# EasyEDA Pro project 电子琴键盘板.eprj

# Schematic Schematic1
Board Name: Board1; Create Date: 2026-02-20; Page Name: P1; Project Name: 电子琴键盘板; Schematic Name: Schematic1; Update Date: 2026-02-20; BladeWidth: 10; Company: 嘉立创EDA; Page Size: A4; RegionStart: 1; ShowBorder: 1; TitleBlock: 1; TitleBlockPosition: 3; Version: V1.0; XRegionCount: 6; YRegionCount: 4
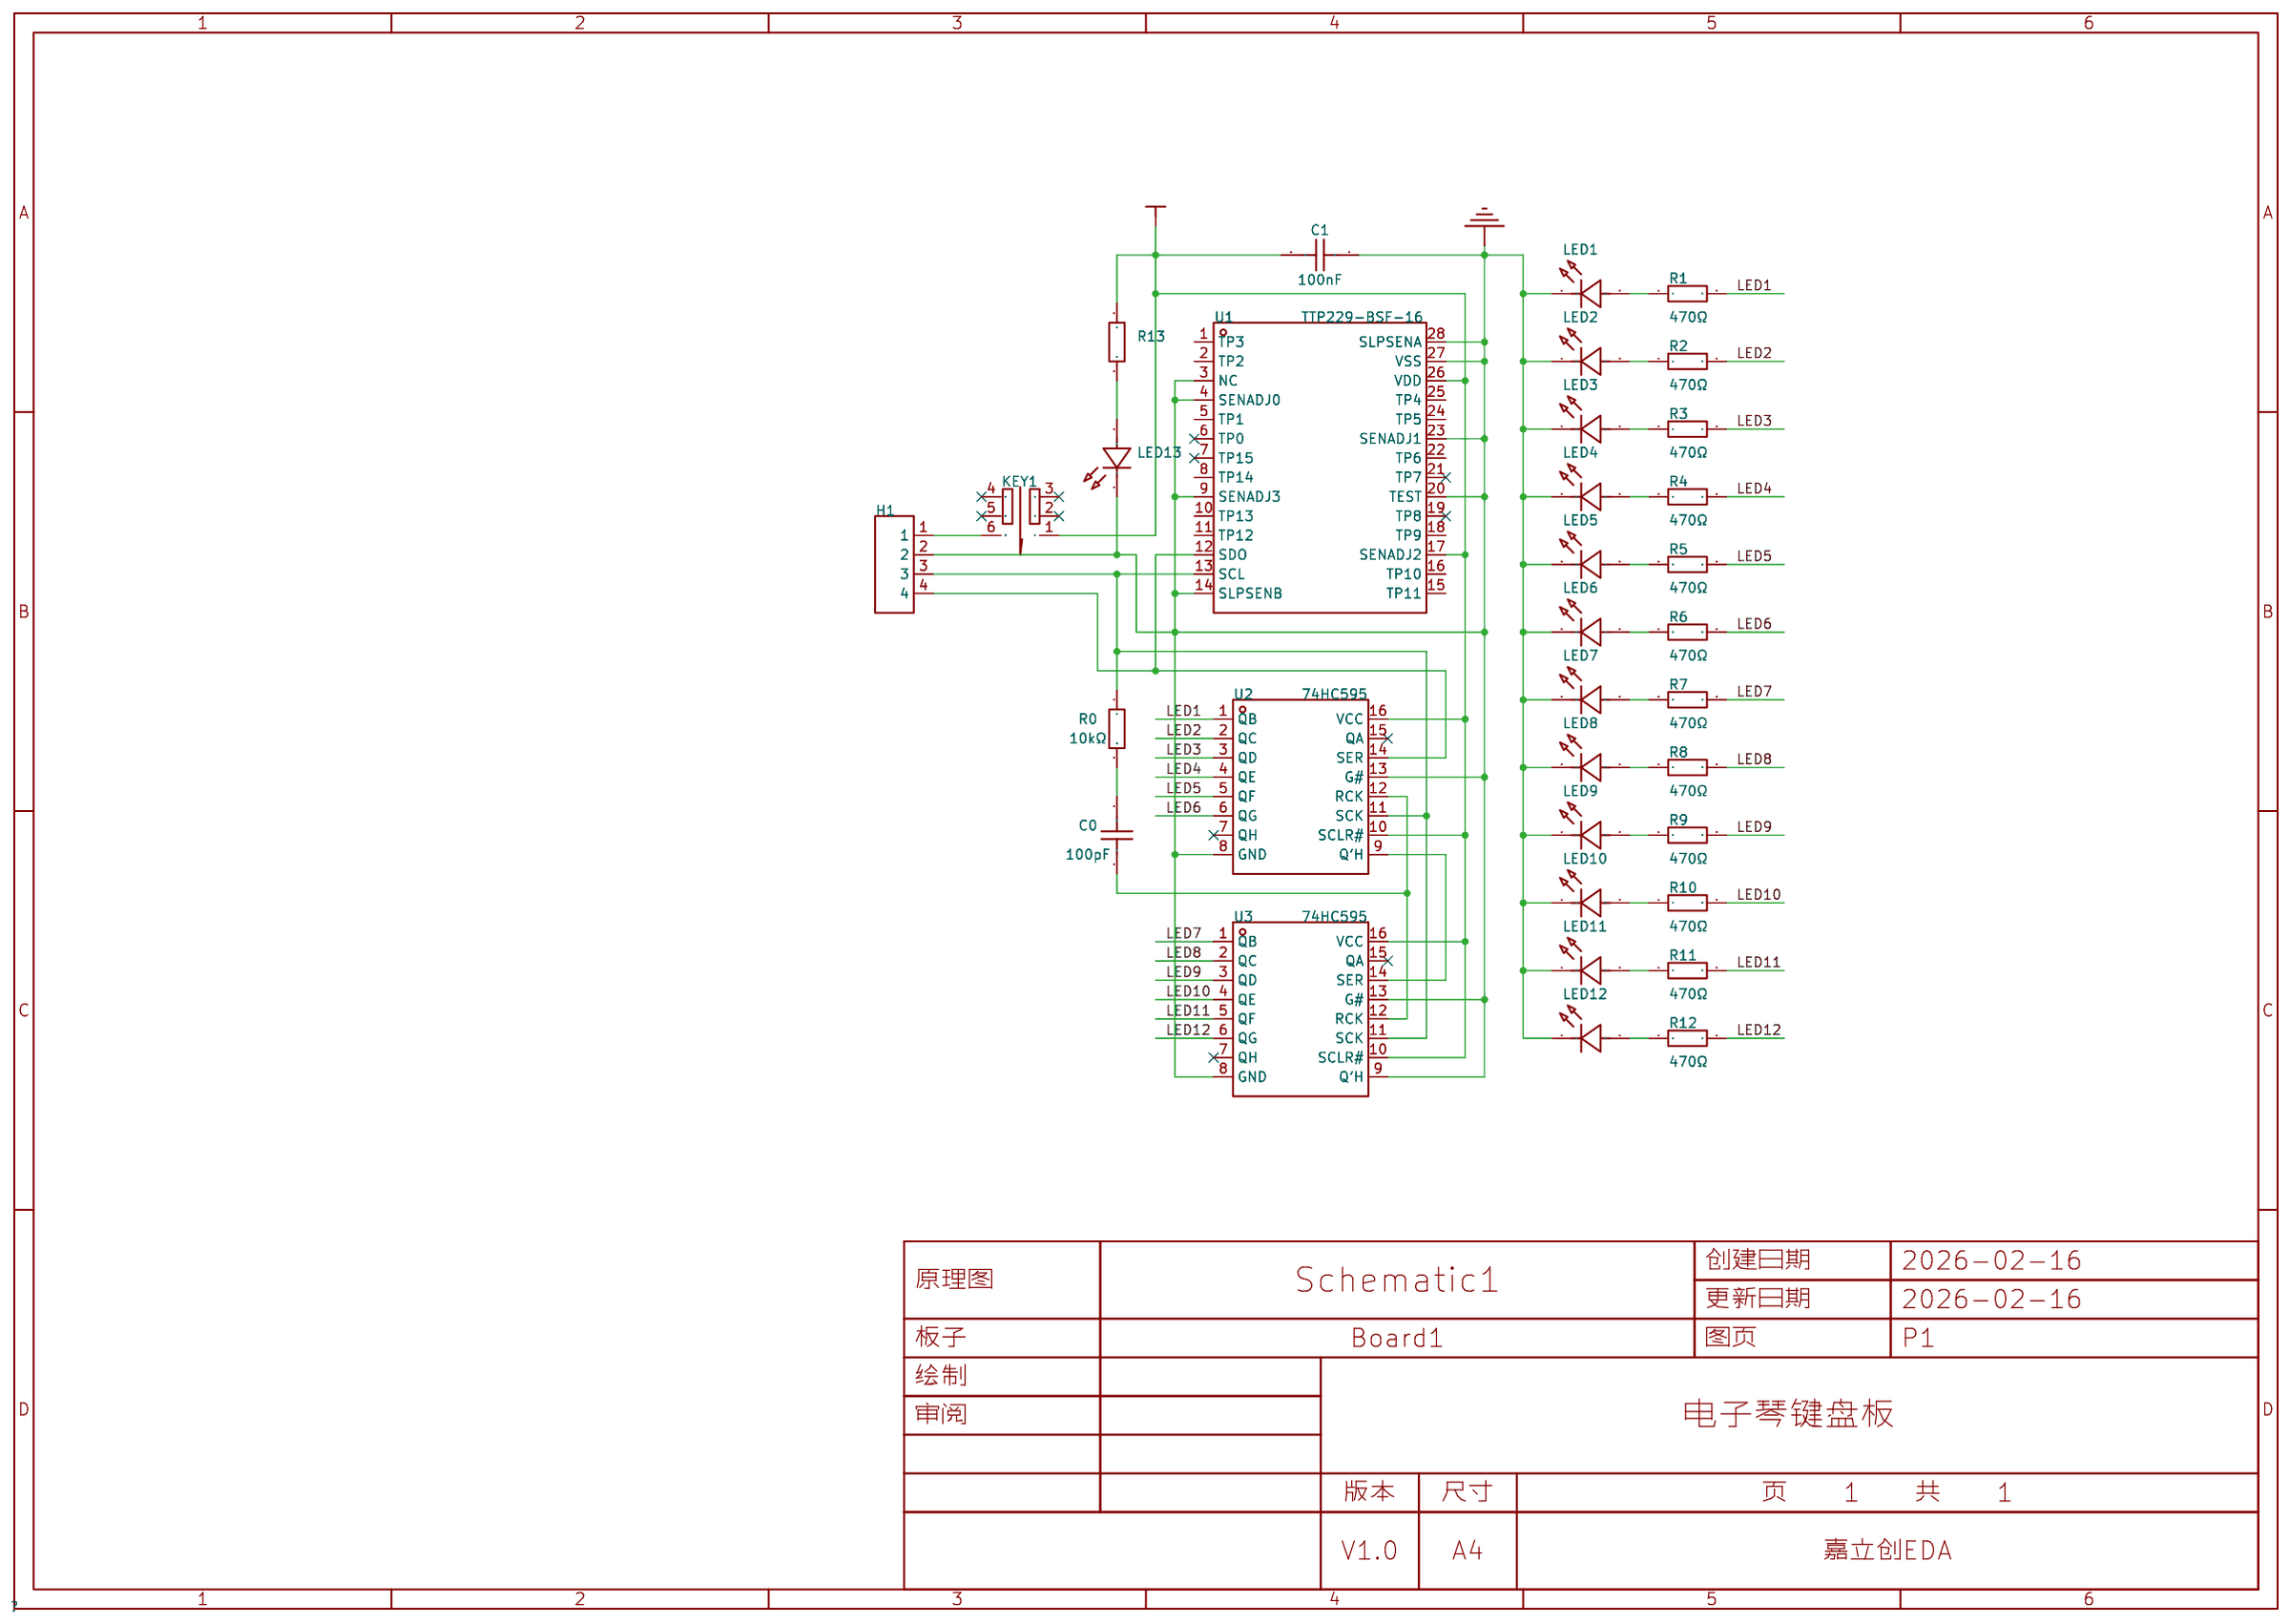
[diagram p0: schematic sheet]

## Parts
C0  100pF  [C0603]
C1  100nF  [C0603]
H1  2.54-1*4  [HDR-TH_4P-P2.54-V-M-1]
KEY1  自锁开关 5.8Z白灰白260G  [SW-TH_6P-L5.8-W5.8-P2.00-LS4.5-TR]
LED1  GL0603UB01  [LED0603-RD_BLUE]
LED2  GL0603UB01  [LED0603-RD_BLUE]
LED3  GL0603UB01  [LED0603-RD_BLUE]
LED4  GL0603UB01  [LED0603-RD_BLUE]
LED5  GL0603UB01  [LED0603-RD_BLUE]
LED6  GL0603UB01  [LED0603-RD_BLUE]
LED7  GL0603UB01  [LED0603-RD_BLUE]
LED8  GL0603UB01  [LED0603-RD_BLUE]
LED9  GL0603UB01  [LED0603-RD_BLUE]
LED10  GL0603UB01  [LED0603-RD_BLUE]
LED11  GL0603UB01  [LED0603-RD_BLUE]
LED12  GL0603UB01  [LED0603-RD_BLUE]
LED13  GL0603UB01  [LED0603-RD_BLUE]
R0  10kΩ  [R0603]
R1  470Ω  [R0603]
R2  470Ω  [R0603]
R3  470Ω  [R0603]
R4  470Ω  [R0603]
R5  470Ω  [R0603]
R6  470Ω  [R0603]
R7  470Ω  [R0603]
R8  470Ω  [R0603]
R9  470Ω  [R0603]
R10  470Ω  [R0603]
R11  470Ω  [R0603]
R12  470Ω  [R0603]
R13  1kΩ  [R0603]
U1  TTP229-BSF-16  [SSOP-28_L9.9-W3.9-P0.64-LS6.0-BL]
U2  74HC595  [SOP-16_L9.9-W3.9-P1.27-LS6.0-BL]
U3  74HC595  [SOP-16_L9.9-W3.9-P1.27-LS6.0-BL]

## Library data of the parts
C0 = CC0603JRNPO9BN101: 容值:100pF;精度:±5%;额定电压:50V;温度系数:NP0;; LCSC Part Name: 100pF ±5% 50V; Supplier Part: C14665; Manufacturer: YAGEO(国巨); Supplier Footprint: 0603; JLCPCB Part Class: 扩展库; Datasheet: https://item.szlcsc.com/datasheet/CC0603JRNPO9BN101/15333.html; Supplier: LCSC; Tolerance: ±5%; Voltage Rating: 50V; Temperature Coefficient: NP0
C1 = CGA0603X7R104K500JT: 容值:100nF;精度:±10%;额定电压:50V;温度系数:X7R;; LCSC Part Name: 100nF ±10% 50V; Supplier Part: C6119867; Manufacturer: HRE(芯声); Supplier Footprint: 0603; JLCPCB Part Class: 扩展库; Datasheet: https://item.szlcsc.com/datasheet/CGA0603X7R104K500JT/7062573.html; Supplier: LCSC; Tolerance: ±10%; Voltage Rating: 50V; Temperature Coefficient: X7R
H1 = 2.54-1*4: 插针结构:1x4P;间距:2.54mm;圆针/方针:方针;安装方式:直插;排数:单排;总PIN位数:4P;额定电流:2.5A;配合针长度:6mm;塑高:2.54mm;端接针长度:3mm;触头材质:黄铜;触头镀层:金;工作温度:-40℃~+105℃;; LCSC Part Name: 1x4P 间距:2.54mm 方针 直插; Supplier Part: C5116483; Manufacturer: ZHOURI(洲日); Supplier Footprint: 插件,P=2.54mm; JLCPCB Part Class: Extended Part; Datasheet: https://item.szlcsc.com/datasheet/2.54-1*4/5692726.html; Supplier: LCSC; Pin Structure: 1x4P; Pitch: 2.54mm; Circluar Pins/Square Pins: 方针; Mounting Type: 直插; Number of Rows: 单排; Number of Pins: 4P; Current Rating: 2.5A; Length of Mating Pin: 6mm; Insulation Height: 2.54mm; Length of End Connection Pin: 3mm; Contact Material: 黄铜; Contact Plating: 金; Operating Temperature: -40℃~+105℃
KEY1 = 自锁开关 5.8Z白灰白260G: 耐温260度; LCSC Part Name: 自锁开关 5.8Z白灰白 260G  5.8*5.8mm; Supplier Part: C56857; Supplier Footprint: 插件; JLCPCB Part Class: Extended Part; Supplier: LCSC
LED1-LED13 = GL0603UB01: 发光颜色:蓝色;正向压降(Vf):2.9V;正向电流:20mA;波长:460nm~469nm;二极管配置:独立二极管;透镜颜色:无色透明透镜;发光强度:72mcd;发光角度:120°;载带方式:正贴;工作温度:-40℃~+85℃;; LCSC Part Name: 0603 蓝灯 高亮; Supplier Part: C51933294; Manufacturer: Guiguang light(桂光光电); Supplier Footprint: 0603; JLCPCB Part Class: Extended Part; Datasheet: https://item.szlcsc.com/datasheet/GL0603UB01/54645990.html; Supplier: LCSC; Illumination Color: 蓝色; Voltage - Forward(Vf): 2.9V; Forward Current: 20mA; Wavelength - Dominant: 460nm~469nm; Diode Configuration: 独立二极管; Lens Color: 无色透明透镜; Luminous Intensity: 72mcd; Viewing Angle: 120°; Mounting Style: 正贴; Operating Temperature: -40℃~+85℃
R0 = 0603WAF1002T5E: 电阻类型:厚膜电阻;阻值:10kΩ;精度:±1%;功率:100mW;工作电压:75V;温度系数:±100ppm/℃;; LCSC Part Name: 厚膜电阻 10kΩ ±1% 100mW; Supplier Part: C25804; Manufacturer: UNI-ROYAL(厚声); Supplier Footprint: 0603; JLCPCB Part Class: Basic Part; Datasheet: https://item.szlcsc.com/datasheet/0603WAF1002T5E/26547.html; Supplier: LCSC; Type: 厚膜电阻; Tolerance: ±1%; Power(Watts): 100mW; Voltage-Supply(Max): 75V; Temperature Coefficient: ±100ppm/℃; Operating Temperature: -55℃~+155℃
R1-R12 = 0603WAF2000T5E: 电阻类型:厚膜电阻;阻值:200Ω;精度:±1%;功率:100mW;工作电压:75V;温度系数:±100ppm/℃;; LCSC Part Name: 200Ω ±1% 100mW 厚膜电阻; Supplier Part: C8218; Manufacturer: UNI-ROYAL(厚声); Supplier Footprint: 0603; JLCPCB Part Class: Basic Part; Datasheet: https://item.szlcsc.com/datasheet/0603WAF2000T5E/8708.html; Supplier: LCSC; Type: 厚膜电阻; Tolerance: ±1%; Power(Watts): 100mW; Voltage-Supply(Max): 75V; Temperature Coefficient: ±100ppm/℃; Operating Temperature: -55℃~+155℃
R13 = RC0603FR-071KL: 电阻类型:厚膜电阻;阻值:1kΩ;精度:±1%;功率:100mW;工作电压:75V;温度系数:±100ppm/℃;; LCSC Part Name: 厚膜电阻 1kΩ ±1% 100mW; Supplier Part: C22548; Manufacturer: YAGEO(国巨); Supplier Footprint: 0603; JLCPCB Part Class: Extended Part; Datasheet: https://item.szlcsc.com/datasheet/RC0603FR-071KL/23274.html; Supplier: LCSC; Type: 厚膜电阻; Tolerance: ±1%; Power(Watts): 100mW; Voltage-Supply(Max): 75V; Temperature Coefficient: ±100ppm/℃; Operating Temperature: -55℃~+155℃
U1 = TTP229-BSF-16: 芯片功能:电容式触摸;; LCSC Part Name: 停产 16键或8键触摸板检测IC; Supplier Part: C82529; Manufacturer: TONTEK(通泰); Supplier Footprint: SSOP-28-150mil; JLCPCB Part Class: 扩展库; Datasheet: https://item.szlcsc.com/datasheet/TTP229-BSF-16/83686.html; Supplier: LCSC; Chip Function: 电容式触摸; Voltage - Supply: 2.4V~5.5V; Current - Supply: 20uA; Operating Temperature: -40℃~+85℃; Standby Current: 2.5uA; ESD Protection Voltage: 6kV; Response Time (tr): 16ms
U2 U3 = 74HC595: 功能:串行至串行或并行;工作电压:2V~6V;时钟频率(fc):10MHz;元件数:1;每个元件位数:8;; LCSC Part Name: 8位CMOS移位寄存器; Supplier Part: C18164493; Manufacturer: GR(国睿); Supplier Footprint: SOP-16; JLCPCB Part Class: 扩展库; Datasheet: https://item.szlcsc.com/datasheet/74HC595/19305556.html; Supplier: LCSC; Function: 串行至串行或并行; Voltage - Supply: 2V~6V; Clock Frequency: 10MHz; Number of Elements: 1; Number of Bits per Element: 8; Output Type: 三态; Series: 74HC; Operating Temperature: -40℃~+85℃; Propagation Delay: 100ns@5V,50pF

## Nets
GND: C1.1 H1.2 LED1.1(K) LED2.1(K) LED3.1(K) LED4.1(K) LED5.1(K) LED6.1(K) LED7.1(K) LED8.1(K) LED9.1(K) LED10.1(K) LED11.1(K) LED12.1(K) LED13.1(K) U1.3(NC) U1.4(SENADJ0) U1.9(SENADJ3) U1.14(SLPSENB) U1.20(TEST) U1.23(SENADJ1) U1.27(VSS) U1.28(SLPSENA) U2.8(GND) U2.13(G#) U3.8(GND) U3.9(Q′H) U3.13(G#)
VCC: C1.2 KEY1.1 R13.1 U1.17(SENADJ2) U1.26(VDD) U2.10(SCLR#) U2.16(VCC) U3.10(SCLR#) U3.16(VCC)
LED1: R1.2 U2.1(QB)
LED2: R2.2 U2.2(QC)
LED3: R3.2 U2.3(QD)
LED4: R4.2 U2.4(QE)
LED5: R5.2 U2.5(QF)
LED6: R6.2 U2.6(QG)
LED7: R7.2 U3.1(QB)
LED8: R8.2 U3.2(QC)
LED9: R9.2 U3.3(QD)
LED10: R10.2 U3.4(QE)
LED11: R11.2 U3.5(QF)
LED12: R12.2 U3.6(QG)
$1N2325: U2.9(Q′H) U3.14(SER)
$1N2334: H1.4 U1.12(SDO) U2.14(SER)
$1N3234: C0.2 U2.12(RCK) U3.12(RCK)
$1N3332: H1.3 R0.1 U1.13(SCL) U2.11(SCK) U3.11(SCK)
$1N3349: C0.1 R0.2
$1N5846: H1.1 KEY1.6
Net-(LED1-2): LED1.2(A) R1.1
Net-(LED2-2): LED2.2(A) R2.1
Net-(LED3-2): LED3.2(A) R3.1
Net-(LED4-2): LED4.2(A) R4.1
Net-(LED5-2): LED5.2(A) R5.1
Net-(LED6-2): LED6.2(A) R6.1
Net-(LED7-2): LED7.2(A) R7.1
Net-(LED8-2): LED8.2(A) R8.1
Net-(LED9-2): LED9.2(A) R9.1
Net-(LED10-2): LED10.2(A) R10.1
Net-(LED11-2): LED11.2(A) R11.1
Net-(LED12-2): LED12.2(A) R12.1
Net-(LED13-2): LED13.2(A) R13.2

Not connected (* = marked no-connect by the designer): KEY1 2* 3* 4* 5*; U1 1(TP3) 2(TP2) 5(TP1) 6(TP0)* 7(TP15)* 8(TP14) 10(TP13) 11(TP12) 15(TP11) 16(TP10) 18(TP9) 19(TP8)* 21(TP7)* 22(TP6) 24(TP5) 25(TP4); U2 7(QH)* 15(QA)*; U3 7(QH)* 15(QA)*

# Board PCB2
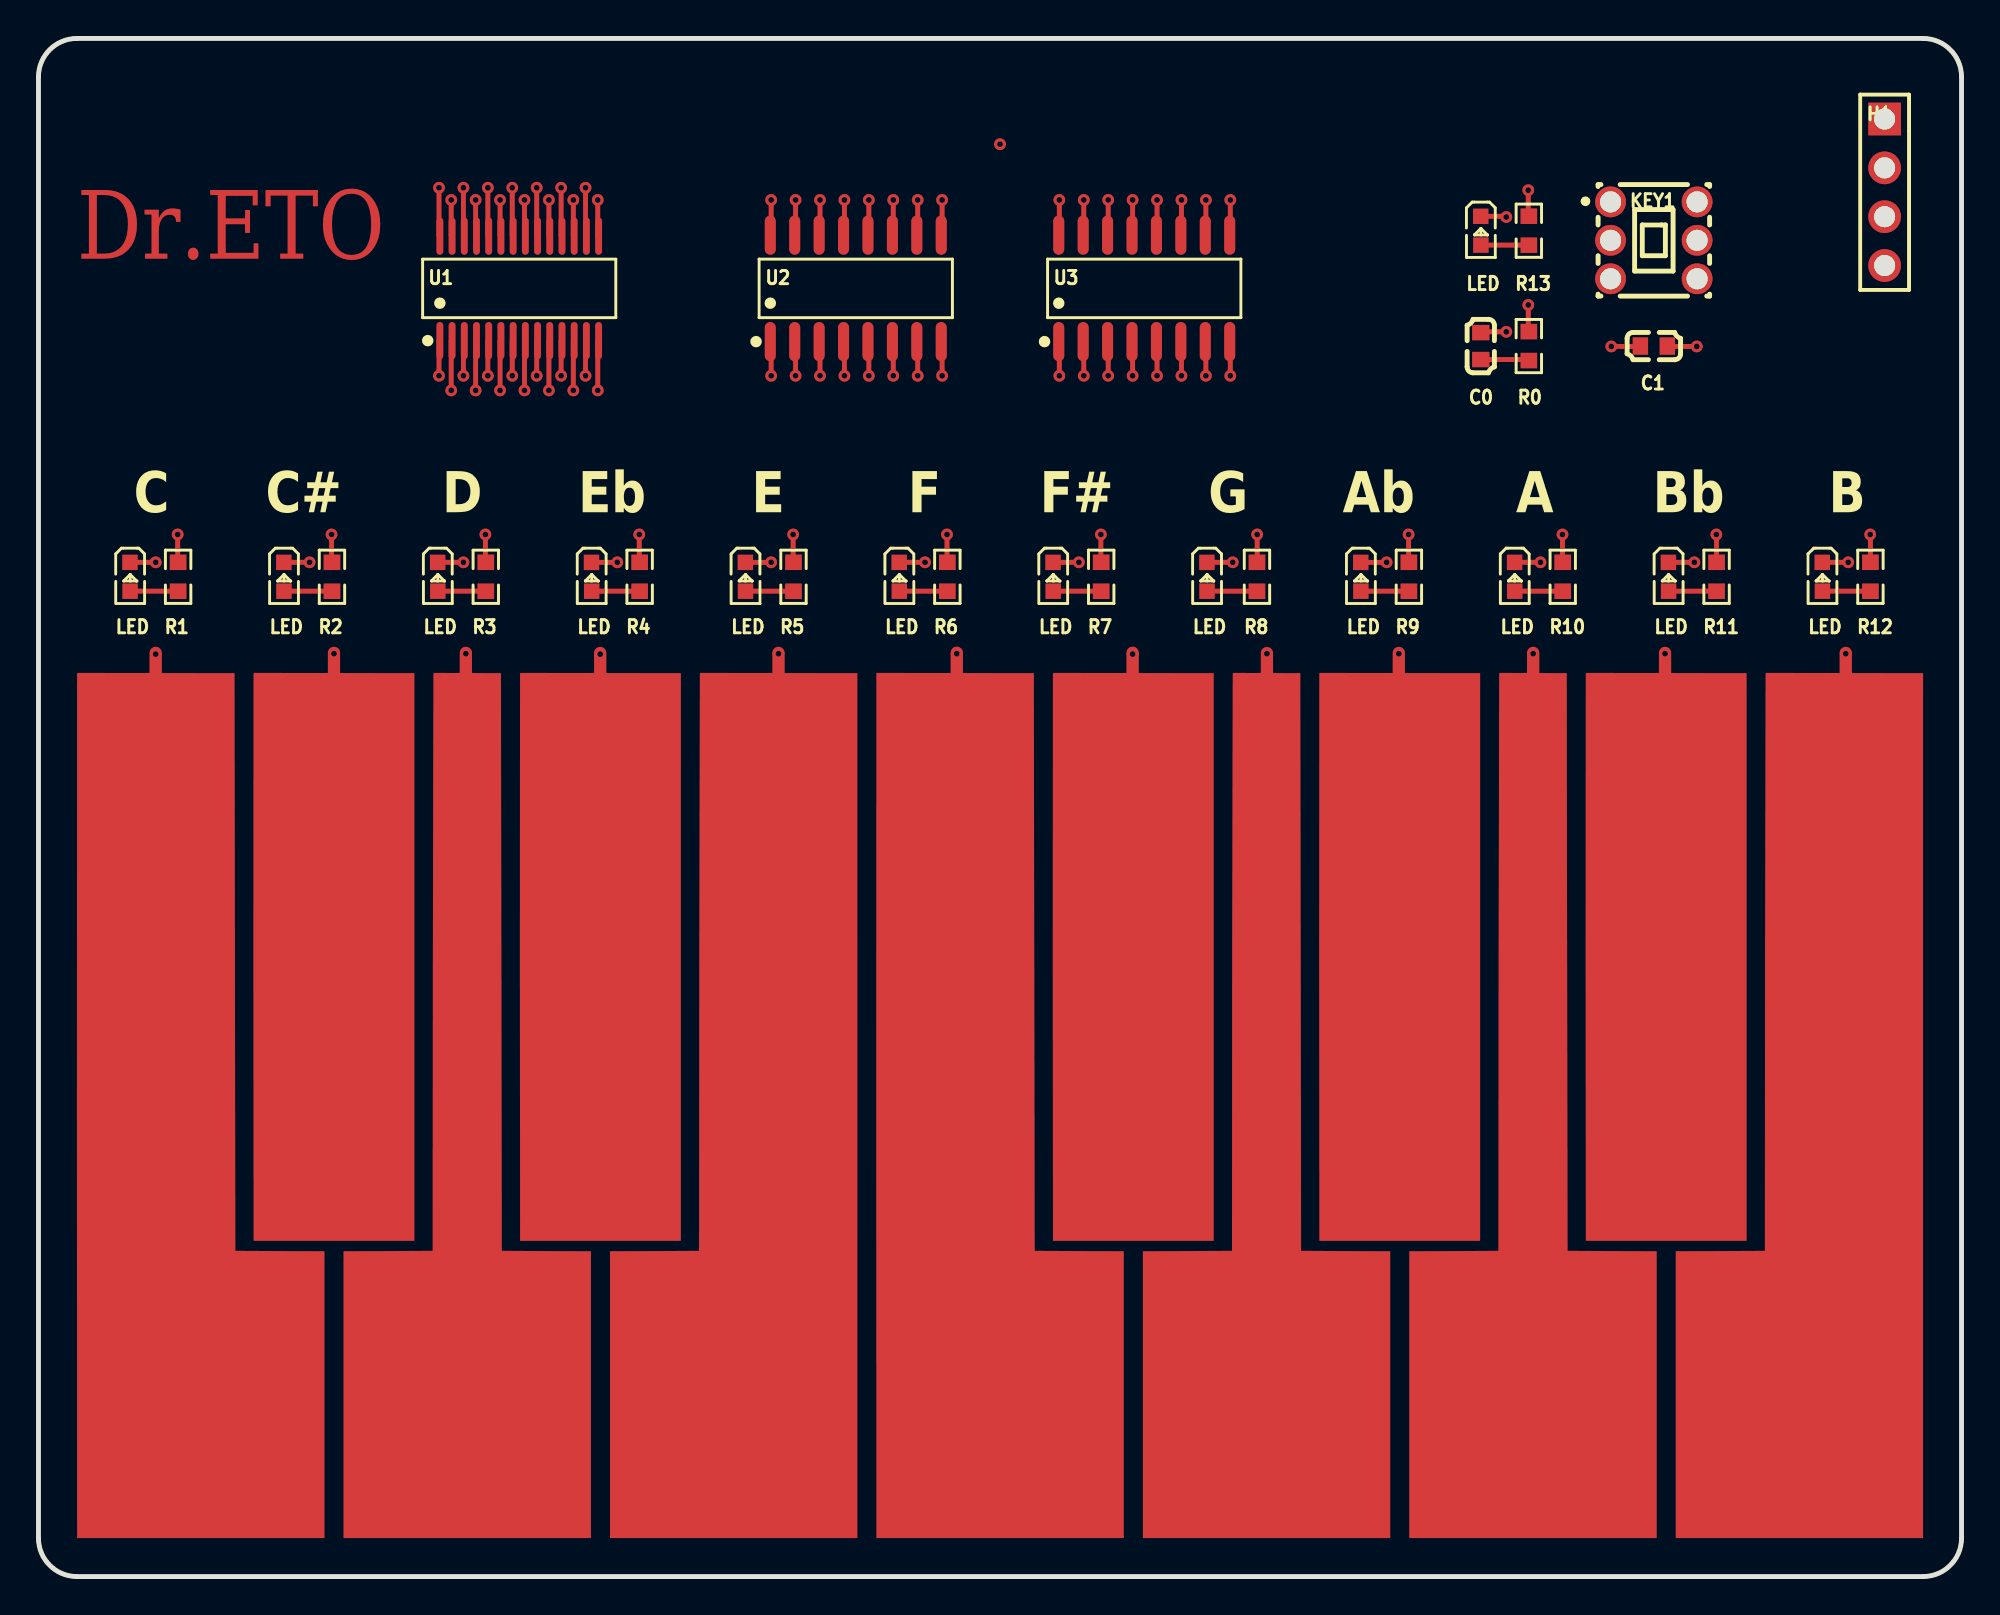
[diagram p1: board, top side]
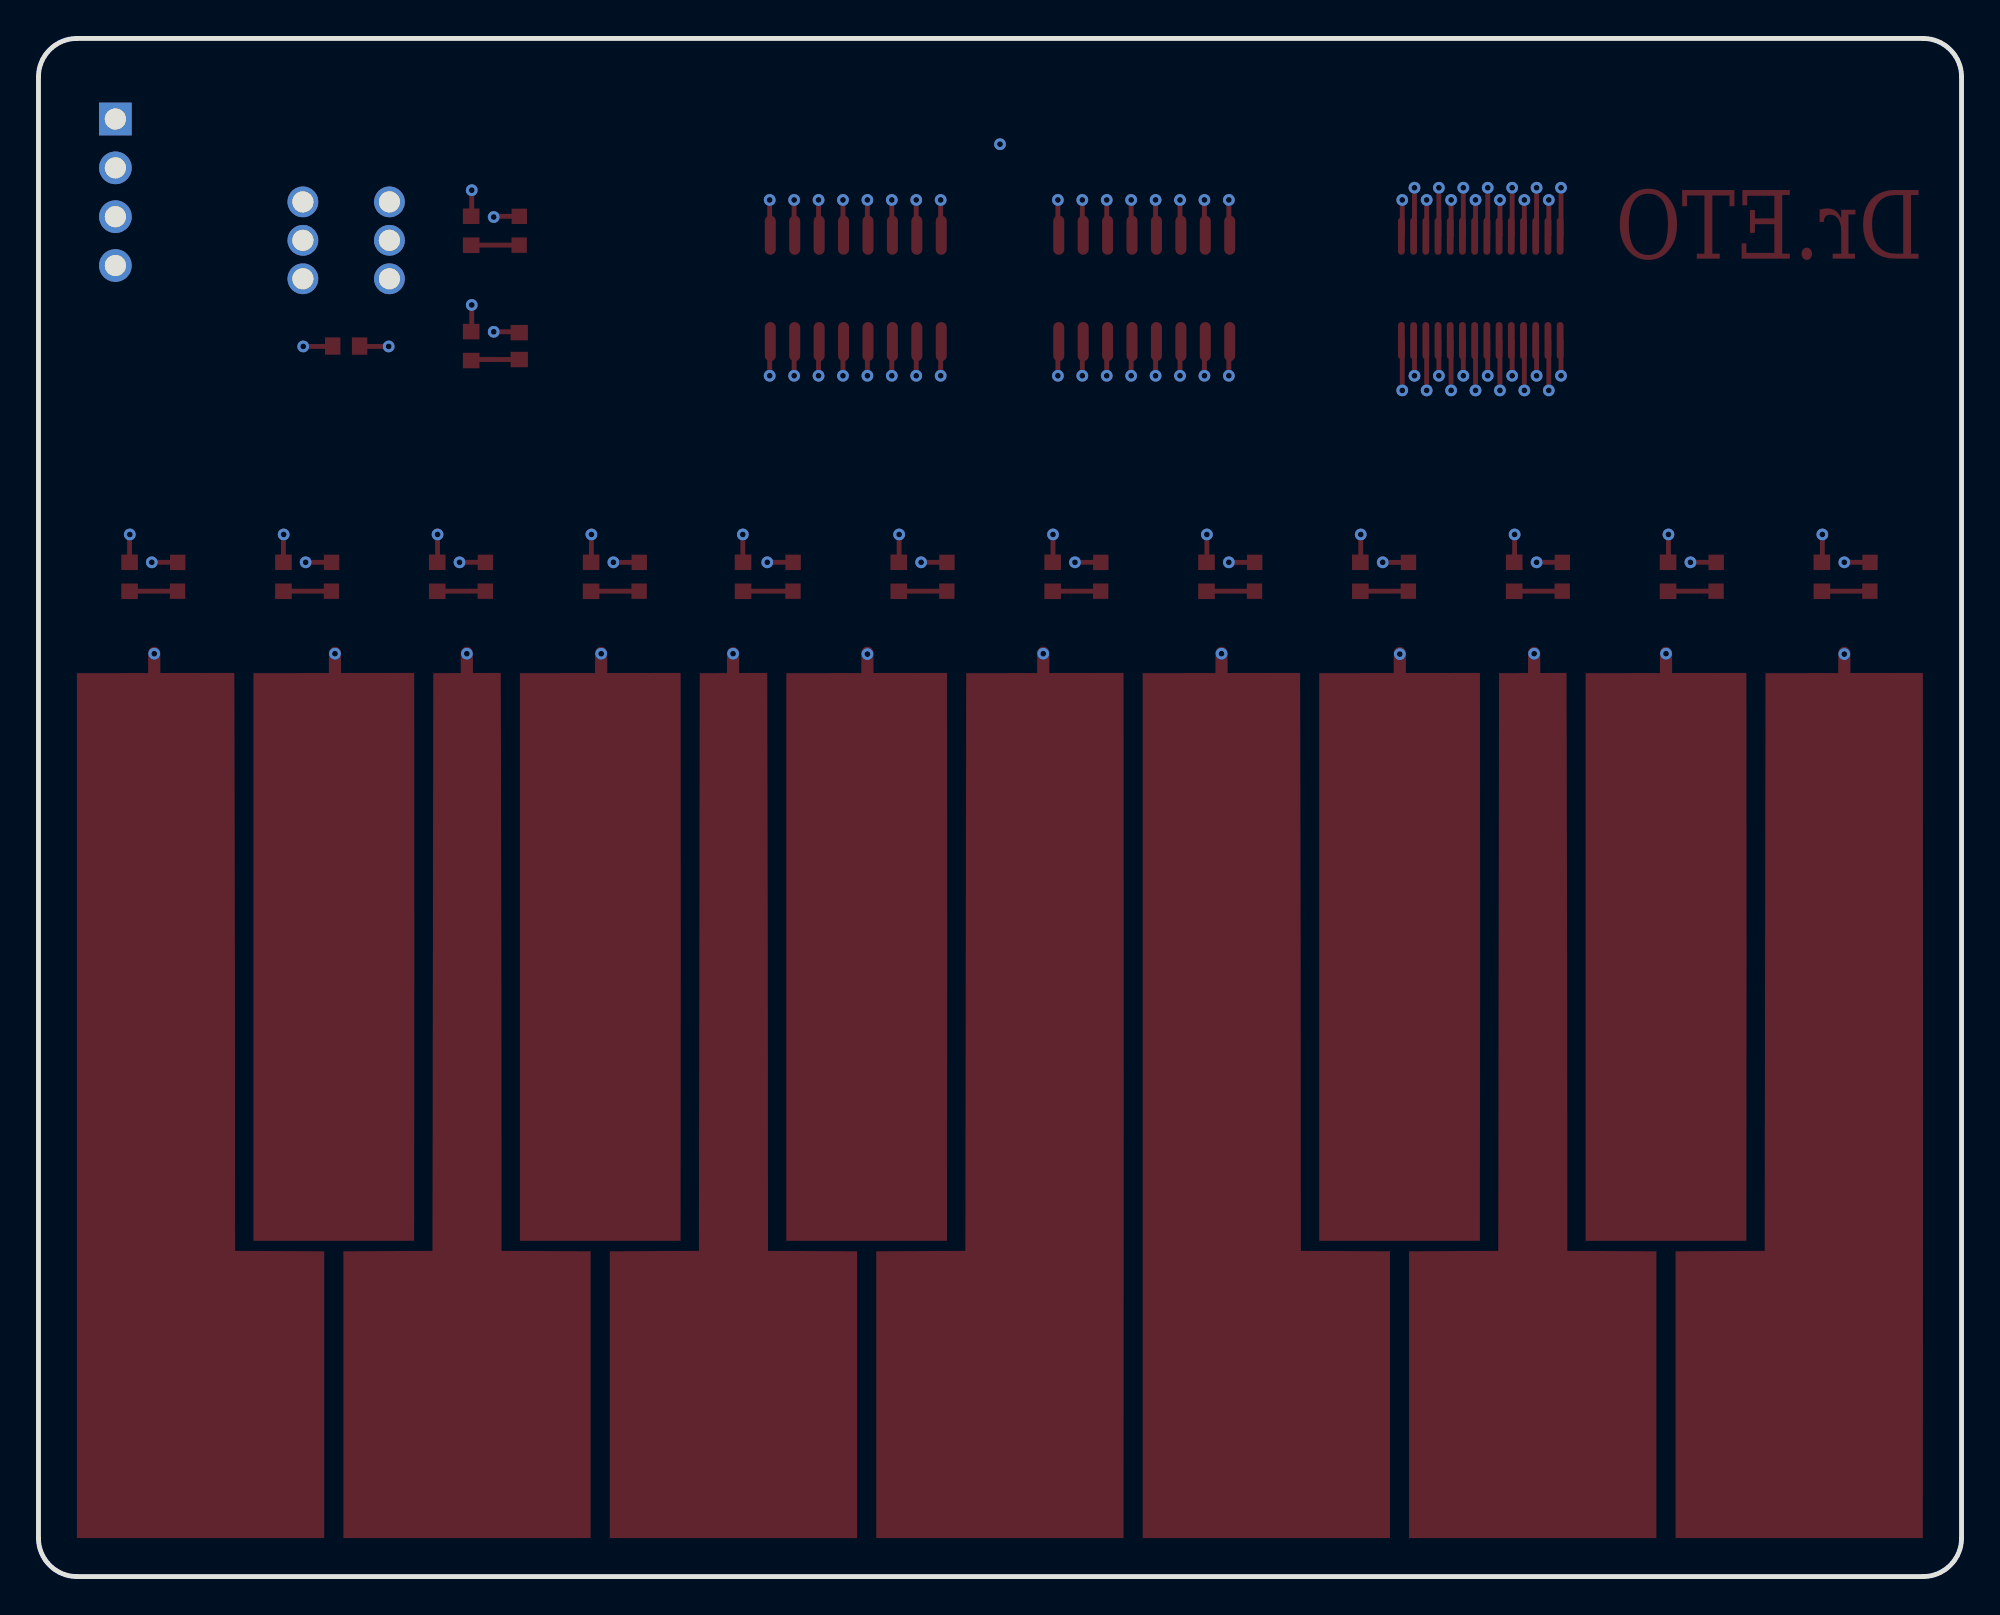
[diagram p2: board, bottom side, seen from below]

Outline 100 x 80 mm; copper layers: Top Layer, Inner1, Inner2, Bottom Layer. Coordinates in mm from the lower left corner of the outline.
Outline path: 0,78 0,2 arc(0.59,0.59) 2,0 98,0 arc(99.41,0.59) 100,2 100,78 arc(99.41,79.41) 98,80 2,80 arc(0.59,79.41) 0,78
Stack: Top Layer 0.035mm Outer layer thickness 1oz / Dielectric1 0.2104mm 7628 RC49% 8.6mil / Inner1 0.0152mm Inner layer thickness / Dielectric2 1.065mm 1.1mm H/HOZ Copper / Inner2 0.0152mm Inner layer thickness / Dielectric3 0.2104mm 7628 RC49% 8.6mil / Bottom Layer 0.035mm Outer layer thickness 1oz

## Design rules (mm)
spacing copperThickness1oz (default): track to track 0.102, other pairs 0.152 to 0.3
spacing copperThickness2oz: track to track 0.203, other pairs 0.152 to 0.3
spacing Plane_innerPlane: track to track 0.102, other pairs 0.152 to 0.3
spacing Copper_copperRegion: track to track 0.102, other pairs 0.152 to 0.3
track width copperThickness1oz (default): min 0.127, default 0.254, max 2.54
track width copperThickness2oz: min 0.203, default 0.254, max 2.54
differential pair differentialPair (default): width min 0.127, default 0.254, max 2.54; gap min 0.152, default 0.152

## Placement (name value [footprint] x y rotation side)
C0  100pF  [C0603]  75 64 90 top
C1  100nF  [C0603]  84 64 180 top
H1  2.54-1*4  [HDR-TH_4P-P2.54-V-M-1]  96 72 270 top
KEY1  自锁开关 5.8Z白灰白260G  [SW-TH_6P-L5.8-W5.8-P2.00-LS4.5-TR]  84 69.5 90 top
LED  -  [LED0603-RD_BLUE]  92.76 52 270 top
LED#2  -  [LED0603-RD_BLUE]  4.76 52 270 top
LED#3  -  [LED0603-RD_BLUE]  12.76 52 270 top
LED#4  -  [LED0603-RD_BLUE]  20.76 52 270 top
LED#5  -  [LED0603-RD_BLUE]  75 70 270 top
LED#6  -  [LED0603-RD_BLUE]  28.76 52 270 top
LED#7  -  [LED0603-RD_BLUE]  36.76 52 270 top
LED#8  -  [LED0603-RD_BLUE]  44.76 52 270 top
LED#9  -  [LED0603-RD_BLUE]  52.76 52 270 top
LED#10  -  [LED0603-RD_BLUE]  60.76 52 270 top
LED#11  -  [LED0603-RD_BLUE]  68.76 52 270 top
LED#12  -  [LED0603-RD_BLUE]  76.76 52 270 top
LED#13  -  [LED0603-RD_BLUE]  84.76 52 270 top
R0  10kΩ  [R0603]  77.5 64 270 top
R1  470Ω  [R0603]  7.26 52 90 top
R2  470Ω  [R0603]  15.26 52 90 top
R3  470Ω  [R0603]  23.26 52 90 top
R4  470Ω  [R0603]  31.26 52 90 top
R5  470Ω  [R0603]  39.26 52 90 top
R6  470Ω  [R0603]  47.26 52 90 top
R7  470Ω  [R0603]  55.26 52 90 top
R8  470Ω  [R0603]  63.36 52 90 top
R9  470Ω  [R0603]  71.26 52 90 top
R10  470Ω  [R0603]  79.26 52 90 top
R11  470Ω  [R0603]  87.26 52 90 top
R12  470Ω  [R0603]  95.26 52 90 top
R13  1kΩ  [R0603]  77.5 70 270 top
U1  TTP229-BSF-16  [SSOP-28_L9.9-W3.9-P0.64-LS6.0-BL]  25 67 0 top
U2  74HC595  [SOP-16_L9.9-W3.9-P1.27-LS6.0-BL]  42.5 67 0 top
U3  74HC595  [SOP-16_L9.9-W3.9-P1.27-LS6.0-BL]  57.5 67 0 top

## Footprints (pads in the part's own frame, mm; a bottom-side part is the same pattern mirrored in y, then rotated)
C0603
  rect 0.8x0.9 smd: 1(-0.7,0) 2(0.7,0)
HDR-TH_4P-P2.54-V-M-1
  rect 1.7x1.7 hole 1.1: 1(-3.81,0)
  round 1.7 hole 1.1: 2(-1.27,0) 3(1.27,0) 4(3.81,0)
LED0603-RD_BLUE
  rect 0.8x0.8 smd: 1(-0.749,-0.004) 2(0.749,0.004)
R0603
  rect 0.806x0.864 smd: 1(-0.753,0) 2(0.753,0)
SOP-16_L9.9-W3.9-P1.27-LS6.0-BL
  oval 0.574x2.038 smd: 1(-4.445,-2.769) 2(-3.175,-2.769) 3(-1.905,-2.769) 4(-0.635,-2.769) 5(0.635,-2.769) 6(1.905,-2.769) 7(3.175,-2.769) 8(4.445,-2.769) 9(4.445,2.769) 10(3.175,2.769) 11(1.905,2.769) 12(0.635,2.769) 13(-0.635,2.769) 14(-1.905,2.769) 15(-3.175,2.769) 16(-4.445,2.769)
SSOP-28_L9.9-W3.9-P0.64-LS6.0-BL
  oval 0.355x1.935 smd: 1(-4.128,-2.717) 2(-3.493,-2.717) 3(-2.857,-2.717) 4(-2.223,-2.717) 5(-1.587,-2.717) 6(-0.953,-2.717) 7(-0.318,-2.717) 8(0.318,-2.717) 9(0.953,-2.717) 10(1.587,-2.717) 11(2.223,-2.717) 12(2.857,-2.717) 13(3.493,-2.717) 14(4.128,-2.717) 15(4.128,2.717) 16(3.493,2.717) 17(2.857,2.717) 18(2.223,2.717) 19(1.587,2.717) 20(0.953,2.717) 21(0.318,2.717) 22(-0.318,2.717) 23(-0.953,2.717) 24(-1.587,2.717) 25(-2.223,2.717) 26(-2.857,2.717) 27(-3.493,2.717) 28(-4.128,2.717)
SW-TH_6P-L5.8-W5.8-P2.00-LS4.5-TR
  round 1.6 hole 1.1: 1(2,2.25) 2(0,2.25) 3(-2,2.25) 4(-2,-2.25) 5(0,-2.25) 6(2,-2.25)

## Nets
GND: C1.1 H1.2 LED.1 LED#2.1 LED#3.1 LED#4.1 LED#5.1 LED#6.1 LED#7.1 LED#8.1 LED#9.1 LED#10.1 LED#11.1 LED#12.1 LED#13.1 U1.3 U1.4 U1.9 U1.14 U1.20 U1.23 U1.27 U1.28 U2.8 U2.13 U3.8 U3.9 U3.13
VCC: C1.2 KEY1.1 R13.1 U1.17 U1.26 U2.10 U2.16 U3.10 U3.16
LED1: R1.2 U2.1
LED2: R2.2 U2.2
LED3: R3.2 U2.3
LED4: R4.2 U2.4
LED5: R5.2 U2.5
LED6: R6.2 U2.6
LED7: R7.2 U3.1
LED8: R8.2 U3.2
LED9: R9.2 U3.3
LED10: R10.2 U3.4
LED11: R11.2 U3.5
LED12: R12.2 U3.6
$1N2325: U2.9 U3.14
$1N2334: H1.4 U1.12 U2.14
$1N3234: C0.2 U2.12 U3.12
$1N3332: H1.3 R0.1 U1.13 U2.11 U3.11
$1N3349: C0.1 R0.2
$1N3431: LED#2.2 R1.1
$1N3516: LED#3.2 R2.1
$1N3601: LED#4.2 R3.1
$1N3686: LED#6.2 R4.1
$1N3771: LED#7.2 R5.1
$1N3856: LED#8.2 R6.1
$1N4494: LED#10.2 R8.1
$1N4496: LED#9.2 R7.1
$1N4502: LED#13.2 R11.1
$1N4506: LED#12.2 R10.1
$1N4508: LED.2 R12.1
$1N4514: LED#11.2 R9.1
$1N5846: H1.1 KEY1.6
$1N5853: LED#5.2 R13.2

Pads without a net: KEY1 2 3 4 5; U1 1 2 5 6 7 8 10 11 15 16 18 19 21 22 24 25; U2 7 15; U3 7 15

## Via types
v1: diameter 0.61, hole 0.305, Top Layer to Bottom Layer, 103 vias

## Routing (per net, layer and track width the routed paths; a pad name or vN(x,y) marks a point on that pad's centre or on a via; arc(x,y) is an arc through that point)
GND: length 347.8
  Top Layer w0.254: v1(70.1,52.75) 70.1,52.75 LED#11.1 ; v1(22.73,61.69) 22.73,64.24 U1.4 ; LED#4.1 20.76,52.75 v1(22.1,52.75) ; U1.27 21.46,69.76 v1(21.46,71.6) ; v1(56.9,71.6) 56.9,69.8 U3.13 ; v1(20.83,72.23) 20.83,69.76 U1.28 ; C1.1 84.72,63.98 v1(86.23,63.98) ; v1(54.1,52.75) 52.76,52.75 LED#9.1 ; v1(25.91,62.46) 25.91,64.24 U1.9 ; U3.9 61.98,69.8 v1(61.98,71.6) ; LED#12.1 76.76,52.75 v1(78.1,52.75) ; U2.13 41.91,69.81 v1(41.91,71.6) ; v1(29.08,61.69) 29.08,64.24 U1.14 ; v1(61.98,62.46) 61.98,64.2 U3.8 ; LED#13.1 84.76,52.75 v1(86.11,52.75) ; v1(30.1,52.75) 30.09,52.75 LED#6.1 ; LED#3.1 12.76,52.75 v1(14.1,52.75) ; v1(22.1,62.46) 22.1,64.24 U1.3 ; U1.20 25.91,69.76 v1(25.91,72.23) ; LED#10.1 60.76,52.75 v1(62.1,52.75) ; v1(38.1,52.75) 38.1,52.75 LED#7.1 ; v1(76.33,70.71) 76.29,70.75 LED#5.1 ; LED.1 92.76,52.75 v1(94.11,52.75) ; v1(24,71.6) 24,69.76 U1.23 ; v1(46.1,52.75) 44.76,52.75 LED#8.1 ; v1(46.99,62.46) 46.99,64.19 U2.8 ; LED#2.1 4.76,52.75 v1(6.1,52.75)
  Inner1 w0.254: 24,73.38 21.46,73.38 ; 24,73.38 25.91,73.38 ; 24,73.38 v1(24,71.6) ; 21.46,73.38 21.08,73.38 20.83,73.12 v1(20.83,72.23) ; 21.46,73.38 21.46,73.37 v1(21.46,71.6) ; v1(25.91,62.46) 25.91,66.01 ; 25.91,66.01 v1(25.91,72.23) 25.91,73.38 ; 25.91,66.01 6.35,66.01 6.1,65.76 v1(6.1,52.75) v1(14.1,52.75) v1(22.1,52.75) v1(30.1,52.75) v1(38.1,52.75) v1(46.1,52.75) v1(54.1,52.75) v1(62.1,52.75) v1(70.1,52.75) v1(78.1,52.75) v1(86.11,52.75) v1(94.11,52.75) 98.93,52.75 99.19,53.01 99.19,73 98.93,73.25 ; 56.9,73.38 41.91,73.38 ; 56.9,73.38 v1(56.9,71.6) ; 56.9,73.38 61.72,73.38 61.98,73.12 v1(61.98,71.6) ; 41.91,73.38 25.91,73.38 ; 41.91,73.38 v1(41.91,71.6) ; 98.93,73.27 H1.2 76.6,73.27 76.33,73 v1(76.33,70.71)
  Inner2 w0.254: 29.09,60.55 46.99,60.55 ; 29.09,60.55 25.91,60.55 ; 29.09,60.55 29.08,60.56 v1(29.08,61.69) ; 46.99,60.55 61.98,60.55 v1(61.98,62.46) ; 46.99,60.55 v1(46.99,62.46) ; 25.91,60.55 22.73,60.55 ; 25.91,60.55 v1(25.91,62.46) ; 22.73,60.55 22.35,60.55 22.1,60.81 v1(22.1,62.46) ; 22.73,60.55 v1(22.73,61.69) ; v1(86.23,63.98) 88.39,63.98 88.39,73.09 88.57,73.27 H1.2
VCC: length 120.2
  Top Layer w0.254: v1(53.09,71.6) 53.09,69.8 U3.16 ; U1.26 22.1,69.76 v1(22.1,72.23) ; v1(60.71,71.6) 60.71,69.8 U3.10 ; v1(38.1,71.6) 38.1,69.81 U2.16 ; v1(27.81,71.6) 27.81,69.76 U1.17 ; v1(45.72,71.6) 45.72,69.81 U2.10 ; R13.1 77.47,70.78 v1(77.47,72.11) ; v1(81.79,63.98) 83.28,63.98 C1.2
  Inner2 w0.254: 38.09,67.92 45.72,67.92 ; 38.09,67.92 27.81,67.92 ; 38.09,67.92 38.1,67.92 v1(38.1,71.6) ; 45.72,67.92 53.09,67.92 ; 45.72,67.92 v1(45.72,71.6) ; v1(60.71,71.6) 60.71,68.17 60.45,67.92 53.09,67.92 ; 79.5,72.11 81.14,72.11 KEY1.1 ; 79.5,72.11 79.5,63.98 v1(81.79,63.98) ; 79.5,72.11 v1(77.47,72.11) 77.47,74.27 77.22,74.52 53.34,74.52 53.09,74.27 v1(53.09,71.6) 53.09,67.92 ; 27.81,67.92 22.28,67.92 22.1,68.1 v1(22.1,72.23) ; 27.81,67.92 27.81,67.92 v1(27.81,71.6)
(no net): length 1050.6
  Top Layer w0.254: v1(26.54,71.6) 26.54,69.76 U1.19 ; U1.1 20.83,64.24 v1(20.83,62.46) ; U2.15 39.37,69.81 v1(39.37,71.6) ; U2.7 45.72,64.19 v1(45.72,62.46) ; v1(26.54,61.69) 26.54,64.24 U1.10 ; U1.7 24.64,64.24 v1(24.64,62.46) ; v1(25.27,61.69) 25.27,64.24 U1.8 ; v1(27.18,72.23) 27.18,69.76 U1.18 ; U1.11 27.18,64.24 v1(27.18,62.46) ; v1(21.46,61.69) 21.46,64.24 U1.2 ; U1.6 24,64.24 v1(24,61.69) ; U3.15 54.36,69.8 v1(54.36,71.6) ; v1(23.37,62.46) 23.37,64.24 U1.5 ; U1.16 28.45,69.76 v1(28.45,72.23) ; v1(24.64,72.23) 24.64,69.76 U1.22 ; U3.7 60.71,64.2 v1(60.71,62.46) ; U1.25 22.73,69.76 v1(22.73,71.6) ; v1(25.27,71.6) 25.27,69.76 U1.21 ; v1(29.08,71.6) 29.08,69.76 U1.15 ; v1(23.37,72.23) 23.37,69.76 U1.24
  Top Layer w0.635: 77.72,46.14 77.72,48.04 ; 70.74,46.13 70.74,48.04 ; 29.21,46.13 29.21,48.04 ; 47.75,46.14 47.75,48.05 ; 56.9,46.14 56.9,48.05 ; 93.98,46.14 93.98,48.04 ; 63.88,46.12 63.88,48.03 ; 38.48,46.14 38.48,48.04 ; 84.58,46.14 84.58,48.04 ; 22.22,46.14 22.22,48.04 ; 6.1,46.14 6.1,48.04 ; 15.37,46.14 15.37,48.04
  Inner2 w0.254: v1(20.83,62.46) 11.43,62.46 11.18,62.2 11.18,47.34 11.43,47.09 21.97,47.09 22.22,47.34 v1(22.22,48) ; v1(38.48,48) 38.48,45.56 38.23,45.31 4.7,45.31 4.44,45.56 4.44,49.5 4.7,49.76 8.25,49.76 8.51,50.01 8.51,74.01 8.76,74.27 23.11,74.27 23.37,74.01 v1(23.37,72.23) ; 22.86,71.6 v1(22.73,71.6) 22.73,73.12 22.48,73.38 9.65,73.38 9.4,73.12 9.4,49.12 9.14,48.87 5.59,48.87 5.33,48.61 5.33,46.45 5.59,46.2 28.96,46.2 29.21,46.45 29.21,47.85 29.34,47.98 ; 47.88,48 47.86,47.98 47.77,47.98 v1(47.75,48) 47.75,44.68 47.5,44.42 3.81,44.42 3.56,44.68 3.56,74.9 3.81,75.16 24.38,75.16 24.64,74.9 v1(24.64,72.23) 24.77,72.23 ; v1(63.88,48) 63.88,43.03 63.63,42.77 2.03,42.77 1.78,43.03 1.78,76.68 2.03,76.93 28.19,76.93 28.45,76.68 v1(28.45,72.23) ; v1(77.72,48) 72.88,48 72.64,48.23 72.64,63.34 72.39,63.6 27.43,63.6 27.18,63.34 v1(27.18,62.46) ; v1(84.58,48) 84.58,48.61 84.33,48.87 73.79,48.87 73.53,49.12 73.53,64.23 73.28,64.49 26.8,64.49 26.54,64.23 v1(26.54,61.69) ; v1(23.37,62.46) 23.37,63.09 23.11,63.34 10.54,63.34 10.29,63.09 10.29,48.23 10.03,47.98 v1(6.1,47.98) ; v1(56.9,47.98) 56.9,43.79 56.64,43.53 2.92,43.53 2.67,43.79 2.67,75.79 2.92,76.05 26.92,76.05 27.18,75.79 v1(27.18,72.23) ; v1(70.74,48) 70.74,41.88 70.56,41.7 1.2,41.7 0.89,42.01 0.89,77.57 1.14,77.82 28.83,77.82 29.08,77.57 v1(29.08,71.6) ; v1(15.37,48) 12.3,48 12.06,48.23 12.06,61.31 12.32,61.57 21.34,61.57 v1(21.46,61.69) ; v1(25.27,61.69) 25.27,65.12 25.53,65.38 74.17,65.38 74.42,65.12 74.42,50.01 74.68,49.76 93.73,49.76 93.98,49.5 v1(93.98,48)
  vias: v1(29.21,47.98)
LED1: length 42.1
  Top Layer w0.254: v1(7.24,54.2) 7.24,52.78 7.26,52.75 ; U2.1 38.1,64.19 v1(38.1,62.46)
  Inner1 w0.254: v1(7.24,54.2) 7.24,59.03 7.49,59.28 37.85,59.28 38.1,59.53 v1(38.1,62.46)
LED2: length 35.3
  Top Layer w0.254: v1(15.24,54.2) 15.24,52.78 R2.2 ; v1(39.37,62.46) 39.37,64.19 U2.2
  Inner1 w0.254: v1(39.37,62.46) 39.37,58.27 39.12,58.01 15.49,58.01 15.24,57.76 v1(15.24,54.2)
LED3: length 28.6
  Top Layer w0.254: v1(23.24,54.2) 23.24,52.77 23.26,52.75 ; v1(40.64,62.46) 40.64,64.19 U2.3
  Inner1 w0.254: v1(23.24,54.2) 23.24,56.49 23.5,56.74 40.39,56.74 40.64,57 v1(40.64,62.46)
LED4: length 21.9
  Top Layer w0.254: v1(31.24,54.2) 31.24,52.77 R4.2 ; v1(41.91,62.46) 41.91,64.19 U2.4
  Inner1 w0.254: v1(41.91,62.46) 41.91,55.72 41.66,55.47 31.5,55.47 31.24,55.22 v1(31.24,54.2)
LED5: length 15.3
  Top Layer w0.254: U2.5 43.18,64.19 v1(43.18,62.46) ; 39.26,52.75 39.24,52.77 v1(39.24,54.2)
  Inner1 w0.254: v1(43.18,62.46) 43.18,54.45 42.93,54.2 v1(39.24,54.2)
LED6: length 14.1
  Top Layer w0.254: v1(44.45,62.46) 44.45,64.19 U2.6 ; 47.26,52.75 47.24,52.77 v1(47.24,54.2)
  Inner1 w0.254: v1(44.45,62.46) 44.45,54.45 44.7,54.2 v1(47.24,54.2)
LED7: length 13.5
  Top Layer w0.254: v1(53.09,62.46) 53.09,64.2 U3.1 ; v1(55.25,54.2) 55.25,52.77 R7.2
  Inner1 w0.254: v1(55.25,54.2) 53.34,54.2 53.09,54.45 v1(53.09,62.46)
LED8: length 20.2
  Top Layer w0.254: U3.2 54.36,64.2 v1(54.36,62.46) ; R8.2 63.37,52.76 v1(63.37,54.2)
  Inner1 w0.254: v1(63.37,54.2) 63.37,55.22 63.12,55.47 54.61,55.47 54.36,55.72 v1(54.36,62.46)
LED9: length 26.8
  Top Layer w0.254: v1(55.63,62.46) 55.63,64.2 U3.3 ; v1(71.25,54.2) 71.25,52.77 71.26,52.75
  Inner1 w0.254: v1(71.25,54.2) 71.25,56.49 70.99,56.74 55.88,56.74 55.63,57 v1(55.63,62.46)
LED10: length 33.6
  Top Layer w0.254: v1(79.25,54.2) 79.25,52.77 R10.2 ; v1(56.9,62.46) 56.9,64.2 U3.4
  Inner1 w0.254: v1(79.25,54.2) 79.25,57.76 78.99,58.01 57.15,58.01 56.9,58.27 v1(56.9,62.46)
LED11: length 40.3
  Top Layer w0.254: 87.26,52.75 87.26,54.19 v1(87.25,54.2) ; U3.5 58.17,64.2 v1(58.17,62.46)
  Inner1 w0.254: v1(58.17,62.46) 58.17,59.53 58.42,59.28 87,59.28 87.25,59.03 v1(87.25,54.2)
LED12: length 47
  Top Layer w0.254: R12.2 95.26,54.19 v1(95.25,54.2) ; U3.6 59.44,64.2 v1(59.44,62.46)
  Inner1 w0.254: v1(59.44,62.46) 59.44,60.81 59.69,60.55 95,60.55 95.25,60.3 v1(95.25,54.2)
$1N2325: length 14.3
  Top Layer w0.254: U2.9 46.99,69.81 v1(46.99,71.6) ; v1(55.63,71.6) 55.63,69.8 U3.14
  Inner1 w0.254: v1(55.63,71.6) 55.63,70.71 55.37,70.46 47.24,70.46 46.99,70.71 v1(46.99,71.6)
$1N2334: length 90
  Top Layer w0.254: v1(27.81,61.69) 27.81,64.24 U1.12 ; U2.14 40.64,69.81 v1(40.64,71.6)
  Inner1 w0.254: 40.64,66.01 28.07,66.01 27.81,65.76 v1(27.81,61.69) ; 40.64,66.01 63.63,66.01 63.88,65.76 63.88,63.34 64.13,63.09 95.75,63.09 96,63.34 H1.4 ; 40.64,66.01 v1(40.64,71.6)
$1N3234: length 52.5
  Top Layer w0.254: v1(58.17,71.6) 58.17,69.8 U3.12 ; v1(76.33,64.74) 75.04,64.74 C0.2 ; v1(43.18,71.6) 43.18,69.81 U2.12
  Inner1 w0.254: v1(43.18,71.6) 43.18,69.44 43.43,69.19 57.91,69.19 58.17,69.44 v1(58.17,71.6)
  Inner2 w0.254: v1(58.17,71.6) 58.17,73.12 58.42,73.38 63.63,73.38 63.88,73.12 63.88,66.52 64.13,66.27 76.07,66.27 76.33,66.01 v1(76.33,64.74)
$1N3332: length 167.7
  Top Layer w0.254: v1(77.47,66.14) 77.47,64.78 R0.1 ; U2.11 44.45,69.81 v1(44.45,71.6) ; v1(28.45,62.46) 28.45,64.24 U1.13 ; U3.11 59.44,69.8 v1(59.44,71.6)
  Inner1 w0.254: v1(50,74.5) 65.58,74.5 65.58,67.92 ; v1(28.45,62.46) 28.45,64.31 28.63,64.49 62.74,64.49 62.99,64.23 62.99,62.08 63.25,61.82 97.66,61.82 97.92,62.08 97.92,70.46 97.64,70.73 H1.3 88.66,70.73 88.39,70.46 88.39,66.39 88.14,66.14 v1(77.47,66.14) 65.91,66.14 65.58,66.47 65.58,67.92 ; v1(59.44,71.6) 59.44,68.17 59.69,67.92 65.58,67.92
  Inner2 w0.254: v1(50,74.5) 44.68,74.5 44.45,74.27 v1(44.45,71.6)
$1N3349: length 2.5
  Top Layer w0.254: R0.2 77.45,63.3 C0.1
$1N3431: length 2.5
  Top Layer w0.254: LED#2.2 7.26,51.25 R1.1
$1N3516: length 2.5
  Top Layer w0.254: R2.1 15.26,51.25 LED#3.2
$1N3601: length 2.5
  Top Layer w0.254: LED#4.2 23.26,51.25 R3.1
$1N3686: length 2.5
  Top Layer w0.254: R4.1 31.26,51.25 LED#6.2
$1N3771: length 2.5
  Top Layer w0.254: R5.1 39.26,51.25 LED#7.2
$1N3856: length 2.5
  Top Layer w0.254: R6.1 47.26,51.25 44.76,51.25
$1N4494: length 2.6
  Top Layer w0.254: R8.1 63.36,51.25 LED#10.2
$1N4496: length 2.5
  Top Layer w0.254: R7.1 55.26,51.25 LED#9.2
$1N4502: length 2.5
  Top Layer w0.254: R11.1 87.26,51.25 LED#13.2
$1N4506: length 2.5
  Top Layer w0.254: LED#12.2 79.26,51.25 R10.1
$1N4508: length 2.5
  Top Layer w0.254: R12.1 95.26,51.25 LED.2
$1N4514: length 2.5
  Top Layer w0.254: LED#11.2 71.26,51.25 R9.1
$1N5846: length 13.9
  Inner2 w0.254: KEY1.6 86.25,75.55 86.51,75.81 H1.1
$1N5853: length 2.5
  Top Layer w0.254: LED#5.2 77.5,69.25 R13.2

Small or netless copper shapes (teardrops, artwork), in the pictures only: 12 on Top Layer

## Text on the board
Top Layer: Dr.ETO
Top Solder Mask Layer: Dr.ETO
Top Silkscreen Layer: C | C# | D | Eb | E | F | F# | G | Ab | A | Bb | B
